# EAGLE design a201-kill-eq (EAGLE 7.5.1)
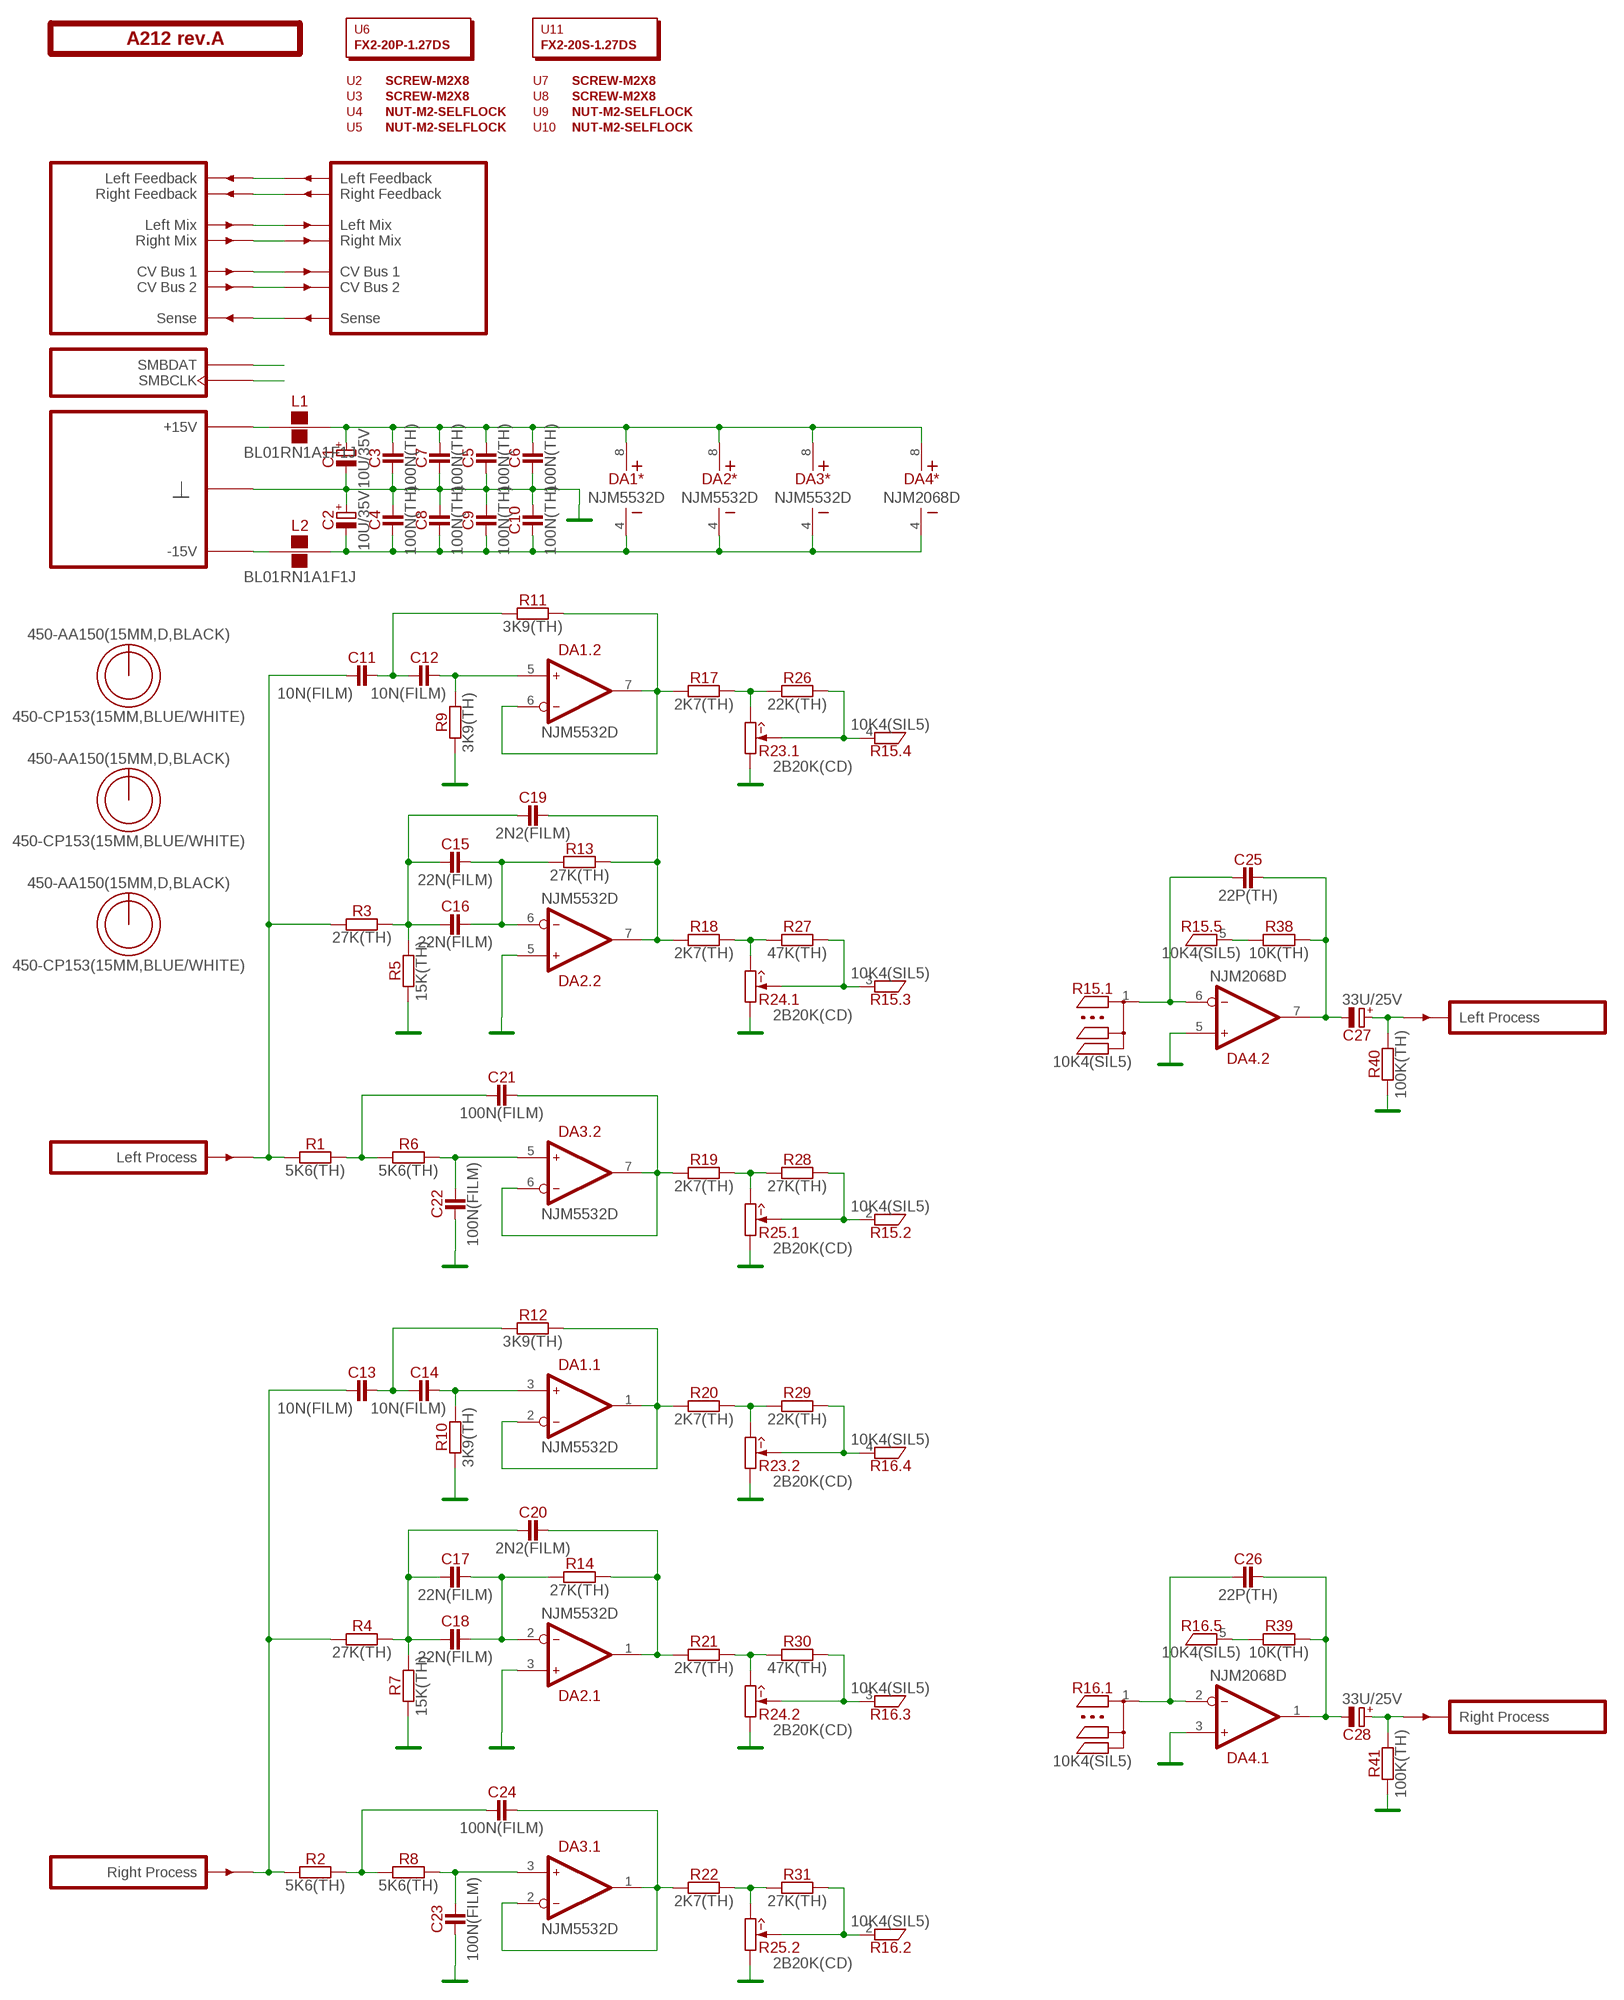
[diagram p0: schematic, sheet 1]

## Parts
C1  10U/35V  [E2-5]
C2  10U/35V  [E2-5]
C3  100N(TH)  [C050-024X044]
C4  100N(TH)  [C050-024X044]
C5  100N(TH)  [C050-024X044]
C6  100N(TH)  [C050-024X044]
C7  100N(TH)  [C050-024X044]
C8  100N(TH)  [C050-024X044]
C9  100N(TH)  [C050-024X044]
C10  100N(TH)  [C050-024X044]
C11  10N(FILM)  [C050-025X075]
C12  10N(FILM)  [C050-025X075]
C13  10N(FILM)  [C050-025X075]
C14  10N(FILM)  [C050-025X075]
C15  22N(FILM)  [C050-025X075]
C16  22N(FILM)  [C050-025X075]
C17  22N(FILM)  [C050-025X075]
C18  22N(FILM)  [C050-025X075]
C19  2N2(FILM)  [C050-025X075]
C20  2N2(FILM)  [C050-025X075]
C21  100N(FILM)  [C050-025X075]
C22  100N(FILM)  [C050-025X075]
C23  100N(FILM)  [C050-025X075]
C24  100N(FILM)  [C050-025X075]
C25  22P(TH)  [C050-024X044]
C26  22P(TH)  [C050-024X044]
C27  33U/25V  [E2,5-7]
C28  33U/25V  [E2,5-7]
DA1  NJM5532D  [DIP-8]
DA2  NJM5532D  [DIP-8]
DA3  NJM5532D  [DIP-8]
DA4  NJM2068D  [DIP-8]
L1  BL01RN1A1F1J  [BL01RN1A]
L2  BL01RN1A1F1J  [BL01RN1A]
O1  450-AA150(15MM,D,BLACK)  [EMPTY]
O2  450-AA150(15MM,D,BLACK)  [EMPTY]
O3  450-AA150(15MM,D,BLACK)  [EMPTY]
O4  450-CP153(15MM,BLUE/WHITE)  [EMPTY]
O5  450-CP153(15MM,BLUE/WHITE)  [EMPTY]
O6  450-CP153(15MM,BLUE/WHITE)  [EMPTY]
PCB1  A212 rev.A  ST2-BOARD-50  [ST2-BOARD-50]
R1  5K6(TH)  [R-0207/10]
R2  5K6(TH)  [R-0207/10]
R3  27K(TH)  [R-0207/10]
R4  27K(TH)  [R-0207/10]
R5  15K(TH)  [R-0207/10]
R6  5K6(TH)  [R-0207/10]
R7  15K(TH)  [R-0207/10]
R8  5K6(TH)  [R-0207/10]
R9  3K9(TH)  [R-0207/10]
R10  3K9(TH)  [R-0207/10]
R11  3K9(TH)  [R-0207/10]
R12  3K9(TH)  [R-0207/10]
R13  27K(TH)  [R-0207/10]
R14  27K(TH)  [R-0207/10]
R15  10K4(SIL5)  [R-SIL5]
R16  10K4(SIL5)  [R-SIL5]
R17  2K7(TH)  [R-0207/10]
R18  2K7(TH)  [R-0207/10]
R19  2K7(TH)  [R-0207/10]
R20  2K7(TH)  [R-0207/10]
R21  2K7(TH)  [R-0207/10]
R22  2K7(TH)  [R-0207/10]
R23  2B20K(CD)  [RV11-DUAL]
R24  2B20K(CD)  [RV11-DUAL]
R25  2B20K(CD)  [RV11-DUAL]
R26  22K(TH)  [R-0207/10]
R27  47K(TH)  [R-0207/10]
R28  27K(TH)  [R-0207/10]
R29  22K(TH)  [R-0207/10]
R30  47K(TH)  [R-0207/10]
R31  27K(TH)  [R-0207/10]
R38  10K(TH)  [R-0207/10]
R39  10K(TH)  [R-0207/10]
R40  100K(TH)  [R-0207/10]
R41  100K(TH)  [R-0207/10]
U2  SCREW-M2X8  [EMPTY]
U3  SCREW-M2X8  [EMPTY]
U4  NUT-M2-SELFLOCK  [EMPTY]
U5  NUT-M2-SELFLOCK  [EMPTY]
U6  FX2-20P-1.27DS  [EMPTY]
U7  SCREW-M2X8  [EMPTY]
U8  SCREW-M2X8  [EMPTY]
U9  NUT-M2-SELFLOCK  [EMPTY]
U10  NUT-M2-SELFLOCK  [EMPTY]
U11  FX2-20S-1.27DS  [EMPTY]

## Nets
GND: C1.- C2.+ C3.1 C4.2 C5.1 C6.1 C7.1 C8.2 C9.2 C10.2 C22.1 C23.1 DA2.3(.1:IN+) DA2.5(.2:IN+) DA4.3(.1:IN+) DA4.5(.2:IN+) PCB1.B4'(GND) PCB1.B4(GND) PCB1.B5'(GND) PCB1.B5(GND) PCB1.B6'(GND) PCB1.B6(GND) PCB1.B7'(GND) PCB1.B7(GND) PCB1.B8'(GND) PCB1.B8(GND) R5.1 R7.1 R9.1 R10.1 R23.1'(.2:CCW) R23.1(.1:CCW) R24.1'(.2:CCW) R24.1(.1:CCW) R25.1'(.2:CCW) R25.1(.1:CCW) R40.1 R41.1
LIO: C11.1 PCB1.BINL(INL) R1.1 R3.1
LIO': C27.+ PCB1.BOUTL'(OUTL) R40.2
N$1: PCB1.ALFBK'(LFBK') PCB1.ALFBK(LFBK)
N$2: PCB1.ARFBK'(RFBK') PCB1.ARFBK(RFBK)
N$3: PCB1.ALMIX'(LMIX') PCB1.ALMIX(LMIX)
N$4: PCB1.ARMIX'(RMIX') PCB1.ARMIX(RMIX)
N$5: PCB1.ACV1'(CV1') PCB1.ACV1(CV1)
N$6: PCB1.ACV2'(CV2') PCB1.ACV2(CV2)
N$7: PCB1.BSENSE'(SENSE') PCB1.BSENSE(SENSE)
N$8: PCB1.ASMBDAT'(SMBDAT) PCB1.ASMBDAT(SMBDAT)
N$9: PCB1.ASMBCLK'(SMBCLK) PCB1.ASMBCLK(SMBCLK)
N$10: C11.2 C12.1 R11.1
N$11: C12.2 DA1.5(.2:IN+) R9.2
N$12: DA1.6(.2:IN-) DA1.7(.2:OUT) R11.2 R17.1
N$13: R17.2 R23.3(.1:CW) R26.1
N$14: R15.4 R23.2(.1:W) R26.2
N$15: C15.1 C16.1 C19.1 R3.2 R5.2
N$16: C15.2 C16.2 DA2.6(.2:IN-) R13.1
N$17: C19.2 DA2.7(.2:OUT) R13.2 R18.1
N$18: R18.2 R24.3(.1:CW) R27.1
N$19: R15.3 R24.2(.1:W) R27.2
N$20: C21.1 R1.2 R6.1
N$21: C22.2 DA3.5(.2:IN+) R6.2
N$22: C21.2 DA3.6(.2:IN-) DA3.7(.2:OUT) R19.1
N$23: R19.2 R25.3(.1:CW) R28.1
N$24: R15.2 R25.2(.1:W) R28.2
N$25: L1.1 PCB1.A+15'(P+15V) PCB1.A+15(P+15V) PCB1.B+15'(P+15V) PCB1.B+15(P+15V)
N$26: R16.5 R39.1
N$27: C13.2 C14.1 R12.1
N$28: C14.2 DA1.3(.1:IN+) R10.2
N$29: DA1.1(.1:OUT) DA1.2(.1:IN-) R12.2 R20.1
N$30: R20.2 R23.3'(.2:CW) R29.1
N$31: R16.4 R23.2'(.2:W) R29.2
N$32: R15.5 R38.1
N$33: C17.1 C18.1 C20.1 R4.2 R7.2
N$34: C17.2 C18.2 DA2.2(.1:IN-) R14.1
N$35: C20.2 DA2.1(.1:OUT) R14.2 R21.1
N$36: R21.2 R24.3'(.2:CW) R30.1
N$37: R16.3 R24.2'(.2:W) R30.2
N$38: C25.2 C27.- DA4.7(.2:OUT) R38.2
N$39: C24.1 R2.2 R8.1
N$40: C23.2 DA3.3(.1:IN+) R8.2
N$41: C24.2 DA3.1(.1:OUT) DA3.2(.1:IN-) R22.1
N$42: R22.2 R25.3'(.2:CW) R31.1
N$43: R16.2 R25.2'(.2:W) R31.2
N$44: C26.2 C28.- DA4.1(.1:OUT) R39.2
N$45: C1.+ C3.2 C5.2 C6.2 C7.2 DA1.8(*:V+) DA2.8(*:V+) DA3.8(*:V+) DA4.8(*:V+) L1.2
N$46: L2.1 PCB1.A-15'(P-15V) PCB1.A-15(P-15V) PCB1.B-15'(P-15V) PCB1.B-15(P-15V)
N$47: C2.- C4.1 C8.1 C9.1 C10.1 DA1.4(*:V-) DA2.4(*:V-) DA3.4(*:V-) DA4.4(*:V-) L2.2
N$48: C28.+ PCB1.BOUTR'(OUTR) R41.2
N$49: C25.1 DA4.6(.2:IN-) R15.1
N$50: C26.1 DA4.2(.1:IN-) R16.1
RIO: C13.1 PCB1.BINR(INR) R2.1 R4.1

## Library data of the parts
C1 C2 = capacitors-electrolytic:?; MOUSER: 647-USW1V100MDD
C3-C10 = capacitors:?; MOUSER: 81-RCER71H104K0A2H3B
C11-C14 = capacitors:?; MOUSER: 80-F622JF103J100C
C15-C18 = capacitors:?; MOUSER: 80-R82EC2220DQ50J
C19 C20 = capacitors:?; MOUSER: 80-PHE426DJ4220JR05
C21-C24 = capacitors:?; MOUSER: 505-MKS2.1/63/5
C25 C26 = capacitors:?
C27 C28 = capacitors-electrolytic:?
DA1-DA3 = ic-jrc:NJM5532; MOUSER: 513-NJM5532D
DA4 = ic-jrc:NJM2068; MOUSER: 513-NJM2068D
L1 L2 = inductors:BL01RN1A?; MOUSER: 81-BL01RN1A1F1J
O1-O3 = hardware:450-AA?; MOUSER: 450-AA150
O4-O6 = hardware:450-C?; MOUSER: 450-CP153
PCB1 = module-footprints:ST2-BOARD-?
R1-R14 R17-R22 R27 R28 R30 R31 = resistors:?
R15 R16 = resistors:?**4(SIL5); MOUSER: 858-L051S103LF
R23-R25 = potentiometers:2**?; MOUSER: 688-RK12L1230C1M
R26 R29 = resistors:?; MOUSER: 71-CCF0722K0GKE36
R38 R39 = resistors:?; MOUSER: 71-RN55D-F-10K
R40 R41 = resistors:?; MOUSER: 71-RN55D-F-100K
U2-U5 U7-U10 = hardware:*?
U6 = hardware:?; MOUSER: 798-FX2-20P-1.27DS71
U11 = hardware:?; MOUSER: 798-FX2-20S-1.27DS71

## Board
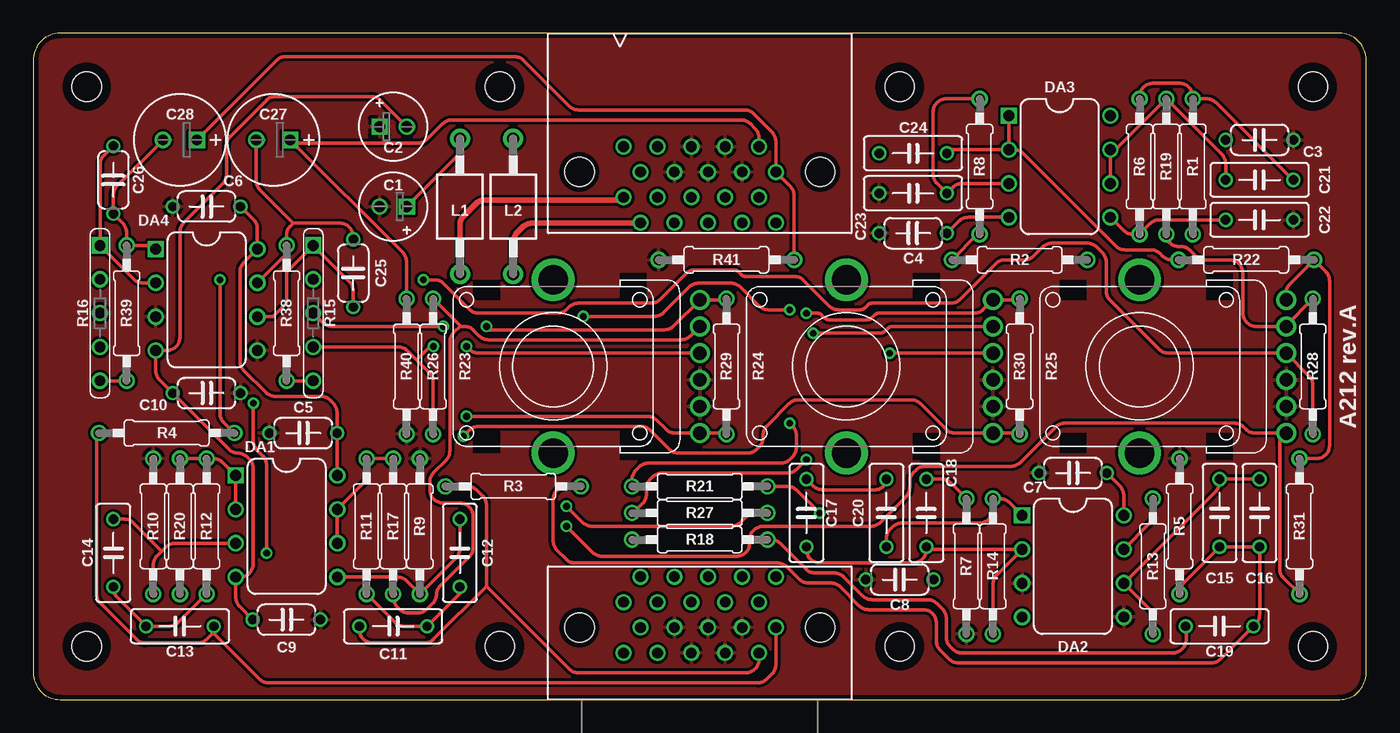
[diagram p1: board, top side]
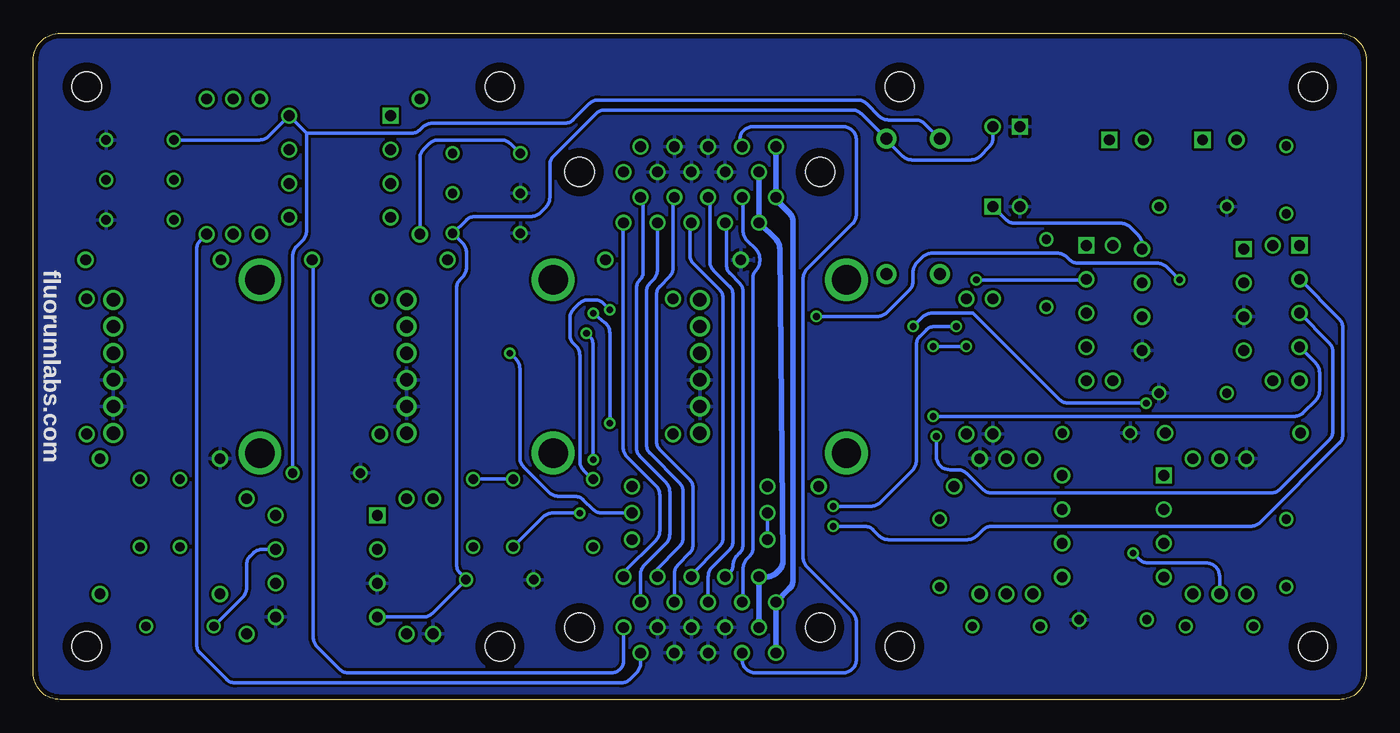
[diagram p2: board, bottom side, seen from below]

Size 100 x 50 mm. Coordinates in mm from the lower left corner, seen from the top.
Outline: 0,48 0,2 arc90 2,0 98,0 arc90 100,2 100,48 arc90 98,50 2,50 arc90 0,48
Copper layers (1*16): Top 0.0356mm / dielectric 1.5011mm / Bottom 0.0356mm
Design rules "sonictrain": minimum track width 6mil, minimum drill 13mil, track to track 8mil, track to pad 8mil, pad to pad 6mil, via to via 6mil, smd to smd 6mil, copper to edge 15mil, drill to drill 6mil, minimum pad ring 7mil, minimum via ring 7mil, stop-mask expansion 3mil, vias tented up to drill 25mil, thermal gap 10mil

### Footprints (pad centres in the part's own frame; a part is rotated, then mirrored left to right if it is on the bottom)
E2-5 = drill 0.813 square: + -1.016,0 | drill 0.813: - 1.016,0
C050-024X044 = drill 0.7: 1 -2.54,0; 2 2.54,0
C050-025X075 = drill 0.7: 1 -2.54,0; 2 2.54,0
E2,5-7 = drill 0.813 square: + -1.27,0 | drill 0.813: - 1.27,0
DIP-8 = drill 0.813 square: 1 -3.81,-3.81 | drill 0.813: 2 -1.27,-3.81; 3 1.27,-3.81; 4 3.81,-3.81; 5 3.81,3.81; 6 1.27,3.81; 7 -1.27,3.81; 8 -3.81,3.81
BL01RN1A = drill 0.9 pad 1.5: 1 -5.08,0; 2 5.08,0
ST2-BOARD-50 = drill 0.8: A+15 44.285,7.31; A+15' 44.285,37.69; A-15 45.555,9.215; A-15' 45.555,35.785; ACV1 51.905,7.31; ACV1' 51.905,37.69; ACV2 53.175,9.215; ACV2' 53.175,35.785; ALFBK 49.365,7.31; ALFBK' 49.365,37.69; ALMIX 46.825,7.31; ALMIX' 46.825,37.69; ARFBK 50.635,9.215; ARFBK' 50.635,35.785; ARMIX 48.095,9.215; ARMIX' 48.095,35.785; ASMBCLK 55.715,9.215; ASMBCLK' 55.715,35.785; ASMBDAT 54.445,7.31; ASMBDAT' 54.445,37.69; B4 48.095,5.405; B4' 48.095,39.595; B5 49.365,3.5; B5' 49.365,41.5; B6 50.635,5.405; B6' 50.635,39.595; B7 51.905,3.5; B7' 51.905,41.5; B8 53.175,5.405; B8' 53.175,39.595; B+15 44.285,3.5; B+15' 44.285,41.5; B-15 45.555,5.405; B-15' 45.555,39.595; BINL 54.445,3.5; BINR 55.715,5.405; BOUTL' 54.445,41.5; BOUTR' 55.715,39.595; BSENSE 46.825,3.5; BSENSE' 46.825,41.5 | hole 2.2: 4,4; 4,46; 96,4; 96,46; 35,46; 65,46; 65,4; 35,4; 59.025,5.405; 40.975,5.405; 40.975,39.595; 59.025,39.595
R-0207/10 = drill 0.813: 1 -5.08,0; 2 5.08,0
R-SIL5 = drill 0.813 square: 1 -5.08,0 | drill 0.813: 2 -2.54,0; 3 0,0; 4 2.54,0; 5 5.08,0
RV11-DUAL = drill 1: 1 -1,-11; 1' -3,-11; 2 1,-11; 2' -5,-11; 3 3,-11; 3' 5,-11 | drill 2.2: S1 -6.5,0; S2 6.5,0

### Placement (x,y rotation side)
C1  27,37 180 top
C2  27,43 0 top
C3  92,42 180 top
C4  66,35 180 top
C5  20.25,20 0 top
C6  13,37 0 top
C7  78,17 0 top
C8  65,9 180 top
C9  19,6 0 top
C10  13,23 0 top
C11  27,5.5 0 top
C12  32,11 90 top
C13  11,5.5 180 top
C14  6,11 90 top
C15  89,14 90 top
C16  92,14 90 top
C17  58,14 270 top
C18  67,14 270 top
C19  89,5.5 180 top
C20  64,14 270 top
C21  92,39 180 top
C22  92,36 180 top
C23  66,38 0 top
C24  66,41 0 top
C25  24,32 90 top
C26  6,39 270 top
C27  18,42 180 top
C28  11,42 180 top
DA1  19,13 270 top
DA2  78,10 270 top
DA3  77,40 270 top
DA4  13,30 270 top
L1  32,37 90 top
L2  36,37 90 top
O1  93,-108 0 top  (outside the outline)
O2  96,-108 0 top  (outside the outline)
O3  99,-108 0 top  (outside the outline)
O4  102,-108 0 top  (outside the outline)
O5  2,-111 0 top  (outside the outline)
O6  5,-111 0 top  (outside the outline)
PCB1  0,0 0 top
R1  87,40 90 top
R2  74,33 180 top
R3  36,16 0 top
R4  10,20 0 top
R5  86,13 270 top
R6  83,40 270 top
R7  70,10 90 top
R8  71,40 90 top
R9  29,13 270 top
R10  9,13 270 top
R11  25,13 90 top
R12  13,13 90 top
R13  84,10 90 top
R14  72,10 90 top
R15  10K*4(SIL5)  [R-SIL5]  21,29 270 top
R16  10K*4(SIL5)  [R-SIL5]  5,29 270 top
R17  27,13 270 top
R18  50,12 180 top
R19  85,40 270 top
R20  11,13 270 top
R21  50,16 180 top
R22  91,33 0 top
R23  2*B20K(CD)  [RV11-DUAL]  39,25 90 top
R24  2*B20K(CD)  [RV11-DUAL]  61,25 90 top
R25  2*B20K(CD)  [RV11-DUAL]  83,25 90 top
R26  30,25 270 top
R27  50,14 0 top
R28  96,25 270 top
R29  52,25 270 top
R30  74,25 270 top
R31  95,13 270 top
R38  19,29 90 top
R39  7,29 90 top
R40  28,25 90 top
R41  52,33 0 top
U2  8,-111 0 top  (outside the outline)
U3  11,-111 0 top  (outside the outline)
U4  14,-111 0 top  (outside the outline)
U5  17,-111 0 top  (outside the outline)
U6  20,-111 0 top  (outside the outline)
U7  23,-111 0 top  (outside the outline)
U8  26,-111 0 top  (outside the outline)
U9  29,-111 0 top  (outside the outline)
U10  32,-111 0 top  (outside the outline)
U11  35,-111 0 top  (outside the outline)

### Tracks (layer width: path | path; a pad name or v marks a point on that pad's centre or on a via)
GND
  pour Bottom: 0,50 100,50 100,0 0,0
  pour Top: 0,50 100,50 100,0 0,0
LIO
  Top 0.254: C11.1 24.46,5.25 arc90 25.46,4.25 29.34,4.25 arc45 30.04,4.54 34,8.5 | 34,8.5 34,14.59 arc45 33.71,15.29 33.29,15.71 arc45 32.59,16 R3.1 | PCB1.BINL 54.45,3 arc-90 53.45,2 40.91,2 arc-45 40.21,2.29 34,8.5
  Bottom 0.254: PCB1.BINL 54.45,2.72 arc45 54.74,2.01 55.21,1.54 arc45 55.91,1.25 84.84,1.25 arc45 85.54,1.54 87.46,3.46 arc45 87.75,4.16 87.75,33.76 arc45 87.46,34.46 R1.1
LIO'
  Top 0.254: R40.2 28,32.86 arc45 27.71,33.56 C27.+ 19.52,41.75 28.84,41.75 arc45 29.54,42.04 30.71,43.21 arc-45 31.41,43.5 53.09,43.5 arc-45 53.79,43.21 54.15,42.85 arc-45 54.45,42.14 PCB1.BOUTL'
N$1
  Bottom 0.254: PCB1.ALFBK 49.37,9.22 arc45 49.07,9.93 47.79,11.21 arc-45 47.5,11.91 47.5,30.34 arc-45 47.79,31.04 48.96,32.21 arc45 49.25,32.91 49.25,37.58 PCB1.ALFBK'
N$2
  Bottom 0.254: PCB1.ARFBK 50.63,9.37 48.54,11.46 arc-45 48.25,12.16 48.25,30.09 arc-45 48.54,30.79 50.46,32.71 arc45 50.75,33.41 50.75,35.67 PCB1.ARFBK'
N$3
  Bottom 0.254: PCB1.ALMIX' 46.75,37.62 46.75,35.16 arc-45 46.46,34.46 45.79,33.79 arc45 45.5,33.09 45.5,32.91 arc45 45.79,32.21 arc-45 46,31.71 46,11.41 arc45 46.29,10.71 46.46,10.54 arc-45 46.75,9.84 46.75,7.38 PCB1.ALMIX
N$4
  Bottom 0.254: PCB1.ARMIX 48.03,9.21 47.74,9.51 arc-45 47.5,10.09 arc45 47.21,10.79 47.04,10.96 arc-45 46.75,11.66 46.75,30.59 arc-45 47.04,31.29 47.71,31.96 arc45 48,32.66 48,35.69 PCB1.ARMIX'
N$5
  Bottom 0.254: PCB1.ACV1' 52,37.59 52,32.41 arc45 52.29,31.71 52.96,31.04 arc-45 53.25,30.34 53.25,19.41 arc-45 52.96,18.71 50.79,16.54 arc45 50.5,15.84 50.5,11.66 arc45 50.79,10.96 51.61,10.14 arc-45 51.91,9.43 PCB1.ACV1
N$6
  Bottom 0.254: PCB1.ACV2' 53.17,32.24 arc45 53.47,31.53 53.71,31.29 arc-45 54,30.59 54,19.16 arc-45 53.71,18.46 51.54,16.29 arc45 51.25,15.59 51.25,12.16 arc45 51.54,11.46 53.25,9.75 53.25,9.29 PCB1.ACV2
N$7
  Bottom 0.254: PCB1.BSENSE 46.83,3 arc-90 45.83,2 39.25,2 arc-90 38.25,3 38.25,5.84 arc-45 38.54,6.54 41.96,9.96 arc45 42.25,10.66 42.25,31.59 arc45 41.96,32.29 38.54,35.71 arc-45 38.25,36.41 38.25,42 arc-90 39.25,43 46,43 arc-90 47,42 47,41.67 PCB1.BSENSE'
N$8
  Bottom 0.254: PCB1.ASMBDAT' 54.25,37.49 54.25,32.04 arc45 54.46,31.54 arc-45 54.75,30.84 54.75,18.91 arc-45 54.46,18.21 52.54,16.29 arc45 52.25,15.59 52.25,12.41 arc45 52.54,11.71 54.15,10.1 arc-45 54.45,9.39 PCB1.ASMBDAT
N$9
  Bottom 0.254: PCB1.ASMBCLK 55.72,9.54 53.29,11.96 arc-45 53,12.66 53,15.34 arc-45 53.29,16.04 55.46,18.21 arc45 55.75,18.91 55.75,35.75 PCB1.ASMBCLK'
N$10
  Top 0.254: R11.1 27.13,5.79 arc45 27.83,5.5 C11.2 32,7.96 C12.1
N$11
  Top 0.254: DA1.5 27.32,9.19 arc-45 28.02,8.9 R9.2 31.71,10.63 arc45 32,11.33 C12.2
N$12
  Top 0.254: DA1.6 DA1.7 24.71,16.17 arc45 25,16.87 R11.2 R17.1
N$13
  Top 0.254: 32.04,28.04 32.08,28 32.34,28 arc-45 33.04,27.71 33.46,27.29 arc45 34.16,27 48.59,27 arc45 49.29,27.29 R23.3 | 32.04,28.04 R26.1 | R17.2 27,7.66 arc45 27.29,6.96 27.46,6.79 arc45 28.16,6.5 28.84,6.5 arc45 29.54,6.79 29.96,7.21 arc45 30.25,7.91 arc-45 30.49,8.49 32.71,10.71 arc45 33,11.41 33,13.75 arc90 32,14.75 30.75,14.75 arc-90 29.75,15.75 29.75,16.34 arc-45 30.04,17.04 30.96,17.96 arc45 31.25,18.66 31.25,26.84 arc-45 31.54,27.54 32.04,28.04
N$14  (via drill 0.5)
  Top 0.254: R15.4 27.38,26.46 arc-45 28.08,26.17 28.75,25.5 | 28.75,25.5 29.71,24.54 arc-45 30,23.84 R26.2 | R23.2 33.41,26 arc-45 32.71,26.29 v32.5,26.5 | v30,26.5 29.75,26.5 28.75,25.5
  Bottom 0.254: 21.04,26.5 R15.4 | v32.5,26.5 v30,26.5
N$15
  Top 0.254: R5.2 86,8.46 C15.1 C16.1 92,6.37 arc-45 91.71,5.67 C19.1 89.08,3.04 arc-45 88.38,2.75 69.41,2.75 arc-45 68.71,3.04 68.04,3.71 arc-45 67.75,4.41 67.75,5.75 arc90 66.75,6.75 62.66,6.75 arc-45 61.96,7.04 60.54,8.46 arc45 59.84,8.75 58.16,8.75 arc-45 57.46,9.04 56.54,9.96 arc45 55.84,10.25 40.66,10.25 arc-45 39.96,10.54 39.29,11.21 arc-45 39,11.91 39,15 arc-90 40,16 R3.2
N$16
  Top 0.254: C16.2 C15.2 89,16.33 arc-45 88.71,15.63 DA2.6 83.71,6.83 arc-45 84,6.13 R13.1
N$17
  Top 0.254: R13.2 84,13.87 arc-45 83.71,13.17 DA2.7 | R18.1 55.34,12 arc-45 56.04,11.71 57.96,9.79 arc45 58.66,9.5 60.09,9.5 arc-45 60.79,9.21 62.21,7.79 arc45 62.91,7.5 67.09,7.5 arc-45 67.79,7.21 68.21,6.79 arc-45 68.5,6.09 68.5,4.66 arc45 68.79,3.96 68.96,3.79 arc45 69.66,3.5 85.5,3.5 arc90 86.5,4.5 86.5,5.46 C19.2
  Bottom 0.254: DA2.7 82.82,11.27 arc-45 83.52,10.98 83.71,10.79 arc-45 84,10.09 84,8.37 arc45 84.29,7.67 C19.2
N$18  (via drill 0.5)
  Top 0.254: R27.1 45,14 45.71,14.71 arc45 46,15.41 46,15.84 arc-45 46.29,16.54 46.46,16.71 arc-45 47.16,17 56.59,17 arc45 57.29,17.29 v58,18 | v58.5,27.5 63.54,27.5 arc45 63.9,27.65 64.1,27.85 arc-45 64.46,28 R24.3
  Bottom 0.254: v58,18 58,26.59 arc-45 58.29,27.29 v58.5,27.5 | R18.2 R27.1
N$19  (via drill 0.5)
  Top 0.254: v64.25,26 R24.2 | R27.2 54.16,14 arc45 53.46,13.71 53.04,13.29 arc-45 52.34,13 41.91,13 arc-45 41.21,13.29 v40,14.5 | v30.75,28 22.41,28 arc-45 21.71,28.29 R15.3
  Bottom 0.254: R27.2 57.34,14 arc45 58.04,14.29 58.71,14.96 arc-45 59.41,15.25 60.59,15.25 arc45 61.29,15.54 63.21,17.46 arc45 63.5,18.16 63.5,24.84 arc-45 63.79,25.54 v64.25,26 | v40,14.5 37.16,14.5 arc-45 36.46,14.79 34.04,17.21 arc-45 33.75,17.91 33.75,26.59 arc45 33.46,27.29 33.04,27.71 arc45 32.34,28 v30.75,28
N$20
  Top 0.254: R6.1 83,45.25 arc-90 84,46.25 86,46.25 arc-90 87,45.25 R1.2 88.05,45.08 arc-45 88.75,44.79 C21.1
N$21
  Top 0.254: DA3.5 81.79,35.21 arc45 82.49,34.92 R6.2 83.79,35.71 arc-45 84.49,36 C22.2
N$22
  Top 0.254: DA3.6 DA3.7 arc45 81.46,41.54 R19.1 89.17,40.91 arc-45 89.46,40.21 C21.2
N$23
  Top 0.254: R28.1 94,28.08 R25.3 91.75,28 arc-90 90.75,29 90.75,32 arc90 89.75,33 87.91,33 arc-45 87.21,33.29 86.79,33.71 arc45 86.09,34 85.92,34 arc-90 R19.2
N$24  (via drill 0.5)
  Top 0.254: R28.2 96,23.59 arc45 95.71,24.29 R25.2 85.16,26 arc-45 84.46,26.29 80.79,29.96 arc-45 80.5,30.66 80.5,32.84 arc45 80.21,33.54 79.79,33.96 arc45 79.09,34.25 76.41,34.25 arc45 75.71,33.96 75.04,33.29 arc-45 74.34,33 72.91,33 arc45 72.21,32.71 69.54,30.04 arc-45 68.84,29.75 62.96,29.75 arc45 62.6,29.6 62.4,29.4 arc-45 62.04,29.25 60.41,29.25 arc-45 59.71,29.54 57.79,31.46 arc45 57.09,31.75 53.46,31.75 arc-45 53.1,31.9 52.9,32.1 arc45 52.54,32.25 49.66,32.25 arc45 48.96,31.96 47.04,30.04 arc-45 46.34,29.75 40.91,29.75 arc45 40.21,29.46 40.04,29.29 arc-45 39.34,29 33.41,29 arc-45 32.71,29.29 30.79,31.21 arc45 30.09,31.5 v29.25,31.5
  Bottom 0.254: v29.25,31.5 21.04,31.5 R15.2
N$25
  Top 0.406: L1.1 32,35.59 arc-45 32.29,36.29 33.21,37.21 arc-45 33.91,37.5 44.09,37.5 PCB1.A+15'
  Bottom 0.406: PCB1.B+15 PCB1.A+15 43.29,8.3 arc-45 43,9.01 43,35.84 arc-45 43.29,36.54 44.28,37.53 PCB1.A+15' PCB1.B+15'
N$26
  Top 0.254: R16.5 R39.1
N$27
  Top 0.254: C14.1 6,8.37 arc45 6.29,7.67 C13.2 10.17,5.5 arc45 10.87,5.79 R12.1
N$28
  Top 0.254: DA1.3 10.64,11.73 arc45 9.94,11.44 9.62,11.12 | 9.62,11.12 9.29,10.79 arc45 9,10.09 R10.2 | C14.2 6.8,13.54 arc-45 7.5,13.25 9.62,11.12
N$29
  Top 0.254: R20.1 R12.2 13.51,18.08 arc-45 14.21,17.79 DA1.1 DA1.2
N$30  (via drill 0.5)
  Top 0.254: R29.1 51.92,30 R23.3' 48.04,28.04 arc-45 47.34,27.75 34.25,27.75 v34,28 | v17.5,11 17.5,17.59 arc45 17.21,18.29 16.79,18.71 arc-45 16.5,19.41 v16.5,22.25
  Bottom 0.254: v34,28 33.29,28.71 arc45 32.59,29 29.5,29 23.04,22.54 arc-45 22.34,22.25 v16.5,22.25 | R20.2 11,9.25 arc-90 12,10.25 16.34,10.25 arc45 17.04,10.54 v17.5,11
N$31  (via drill 0.5)
  Top 0.254: R29.2 51.92,20 R23.2' 48.16,20 arc-45 47.46,20.29 46.79,20.96 arc45 46.09,21.25 v32.5,21.25
  Bottom 0.254: v32.5,21.25 5.41,21.25 arc-45 4.71,21.54 3.79,22.46 arc-45 3.5,23.16 3.5,24.55 arc-45 3.79,25.25 R16.4
N$32
  Top 0.254: R38.1 R15.5
N$33  (via drill 0.5)
  Top 0.254: C18.1 68.13,16.54 arc-45 68.83,16.25 R7.2 | C20.1 arc-90 63.21,15.75 59.2,15.75 arc-45 58.5,16.04 C17.1 | v56.75,29.25 55.16,29.25 arc-45 54.46,29.54 53.04,30.96 arc45 52.34,31.25 49.91,31.25 arc45 49.21,30.96 47.29,29.04 arc-45 46.59,28.75 v41.25,28.75 | v14,31.5 14,21.49 arc45 14.29,20.79 R4.2
  Bottom 0.254: C20.1 C18.1 | C17.1 58.04,16.54 58.71,17.21 arc45 59,17.91 59,25.84 arc-45 59.29,26.54 59.46,26.71 arc45 59.75,27.41 59.75,28.59 arc45 59.46,29.29 59.04,29.71 arc45 58.34,30 57.91,30 arc45 57.21,29.71 v56.75,29.25 | v41.25,28.75 36.66,28.75 arc-45 35.96,29.04 34.29,30.71 arc-45 34,31.41 34,32.09 arc45 33.71,32.79 33.29,33.21 arc45 32.59,33.5 23.16,33.5 arc45 22.46,33.21 22.29,33.04 arc-45 21.59,32.75 15.66,32.75 arc45 14.96,32.46 v14,31.5
N$34
  Top 0.254: R14.1 72,8.67 arc-45 72.29,9.37 DA2.2 67.19,11.27 C18.2 67,11.25 arc-90 66,10.25 59,10.25 arc-90 58,11.25 C17.2
N$35  (via drill 0.5)
  Top 0.254: DA2.1 73.21,14.79 arc45 72.51,15.08 R14.2 72,14.25 arc-90 71,13.25 65.16,13.25 arc45 64.46,12.96 64.29,12.79 arc45 64,12.09 C20.2 | R21.1 56.59,16 arc-45 57.29,15.71 v59,14
  Bottom 0.254: v59,14 61.05,14 arc-45 61.75,13.71 C20.2
N$36  (via drill 0.5)
  Top 0.254: R30.1 73.92,30 R24.3' 71.29,29.29 arc-45 70.59,29 63.46,29 arc45 63.1,28.85 62.9,28.65 arc-45 62.54,28.5 59.71,28.5 arc-45 59.35,28.65 59.15,28.85 arc45 58.79,29 v58,29 | R21.2 44.92,16.51 arc-45 45.21,17.21 45.46,17.46 arc-45 46.16,17.75 56.09,17.75 arc45 56.79,18.04 56.96,18.21 arc45 57.25,18.91 57.25,19.84 arc45 56.96,20.54 v56.75,20.75
  Bottom 0.254: v56.75,20.75 56.75,27.52 arc-51 57.12,28.3 v58,29
N$37  (via drill 0.5)
  Top 0.254: R30.2 73.92,20 R24.2' 69.16,20 arc-45 68.46,20.29 66.54,22.21 arc45 65.84,22.5 57.41,22.5 arc45 56.71,22.21 55.04,20.54 arc45 54.75,19.84 54.75,19.66 arc-45 54.46,18.96 54.29,18.79 arc-45 53.59,18.5 48.41,18.5 arc-45 47.71,18.79 46.29,20.21 arc45 45.59,20.5 33.41,20.5 arc45 32.71,20.21 v32.25,19.75
  Bottom 0.254: R16.3 2.79,26.79 arc45 2.5,26.09 2.5,20.16 arc45 2.79,19.46 6.46,15.79 arc45 7.16,15.5 28.09,15.5 arc45 28.79,15.79 29.96,16.96 arc-45 30.66,17.25 31.25,17.25 arc90 32.25,18.25 v32.25,19.75
N$38
  Top 0.254: DA4.7 19,33.46 R38.2 19,34.84 arc-45 19.29,35.54 19.5,35.75 | 19.5,35.75 23,35.75 arc-90 24,34.75 C25.2 | C27.- 16.73,38.93 arc45 17.02,38.23 19.5,35.75
N$39
  Top 0.254: R8.1 70.84,34.92 R2.2
  Bottom 0.254: C24.1 63.5,41 64.21,41.71 arc-45 64.91,42 69.59,42 arc-45 70.29,41.71 70.71,41.29 arc-45 71,40.59 R8.1
N$40
  Top 0.254: DA3.3 69.68,38.73 arc45 68.98,38.44 C23.2 67.79,38.75 arc-45 67.5,39.45 67.5,44.08 arc-90 68.5,45.08 R8.2
N$41
  Top 0.254: DA3.2 DA3.1 | DA3.2 69.19,41.27 arc45 C24.2 | R22.1 85.41,33 arc-45 84.71,33.29 84.54,33.46 arc45 83.84,33.75 81.91,33.75 arc-45 81.21,34.04 74.29,40.96 arc45 73.59,41.25 73.21,41.25 DA3.2
N$42
  Top 0.254: R25.3' 94,30.51 arc-45 94.29,31.21 R22.2 96.96,32.12 arc-45 97.25,31.42 97.25,19.08 arc-90 96.25,18.08 R31.1
N$43  (via drill 0.5)
  Top 0.254: R31.2 93.79,9.13 arc-45 93.5,9.83 93.5,19.09 arc-45 93.79,19.79 R25.2' 91.66,20 arc-45 90.96,20.29 90.79,20.46 arc45 90.09,20.75 77.41,20.75 arc45 76.71,20.46 74.04,17.79 arc-45 73.34,17.5 66.91,17.5 arc45 66.21,17.21 66.04,17.04 arc45 65.75,16.34 65.75,15.91 arc-45 65.46,15.21 63.54,13.29 arc-45 62.84,13 54.75,13 arc90 53.75,12 53.75,11.75 arc-90 52.75,10.75 42.66,10.75 arc-45 41.96,11.04 v40,13
  Bottom 0.254: v40,13 37.66,13 arc45 36.96,12.71 36.54,12.29 arc-45 35.84,12 29.91,12 arc-45 29.21,12.29 28.79,12.71 arc45 28.09,13 8.66,13 arc-45 7.96,13.29 2.04,19.21 arc-45 1.75,19.91 1.75,27.88 arc-45 2.04,28.58 R16.2
N$44
  Top 0.254: DA4.1 arc45 8.54,34.08 R39.2 7,35.05 arc45 6.71,35.75 C26.2 6,37.86 arc-45 6.29,38.56 C28.-
N$45
  Top 0.254: DA2.8 81.81,15.32 arc45 81.52,16.02 C7.2 | C6.2 16.52,36.02 arc-45 16.81,35.32 DA4.8 15.79,32.79 arc45 15.5,32.09 15.5,25.41 arc45 15.79,24.71 17.46,23.04 arc45 18.16,22.75 21.59,22.75 arc-45 22.29,22.46 22.5,22.25 arc-45 22.79,21.55 C5.2 22.81,19.98 DA1.8 | L1.2 32,41.4 arc-45 31.71,40.69 C1.+
  Bottom 0.254: C3.2 83.03,42 arc-45 82.33,42.29 DA3.8 79.5,42.5 | DA4.8 16.81,34.15 arc-45 17.1,34.85 17.71,35.46 arc-45 18.41,35.75 26.35,35.75 arc45 27.06,36.04 C1.+ | C7.2 80.54,33.3 arc45 80.25,34 79.79,34.46 arc-45 79.5,35.16 79.5,42.5 | 79.5,42.5 71.66,42.5 arc-45 70.96,42.79 70.79,42.96 arc45 70.09,43.25 60.16,43.25 arc-45 59.46,43.54 58.29,44.71 arc45 57.59,45 38.16,45 arc45 37.46,44.71 36.54,43.79 arc-45 35.84,43.5 33.83,43.5 arc45 33.13,43.21 L1.2
N$46
  Top 0.406: L2.1 36,34.34 arc-45 36.29,35.04 36.71,35.46 arc-45 37.41,35.75 45.52,35.75 PCB1.A-15'
  Bottom 0.406: PCB1.B-15 PCB1.A-15 44.95,9.21 arc-45 44.24,9.51 44.05,9.7 arc-46 43.75,10.42 44,33.84 arc-44 44.29,34.54 45.48,35.73 | PCB1.B-15' PCB1.A-15' 45.5,35.73 45.48,35.73 | 45.48,35.73 45.25,35.5 | 45.48,35.73 45.5,35.75
N$47
  Top 0.254: DA3.4 70.14,36.19 arc45 69.44,35.9 C4.1 | C9.1 15.48,6.98 arc-45 15.19,7.68 DA1.4 15.5,9.19 arc90 16.5,10.19 16.5,17.34 arc45 16.21,18.04 16.04,18.21 arc45 15.34,18.5 arc-45 14.69,18.77 C10.1 9.48,23.98 arc-45 9.19,24.68 DA4.4 10,26.19 arc90 11,27.19 11,35.09 arc-45 11.29,35.79 14.21,38.71 arc45 14.5,39.41 14.5,41.59 arc-45 14.79,42.29 17.46,44.96 arc-45 18.16,45.25 25.35,45.25 arc-45 26.06,44.96 C2.-
  Bottom 0.254: DA2.4 70.76,6.19 arc-45 70.06,6.48 C8.1 67.54,9.04 67.96,9.46 arc45 68.25,10.16 68.25,30.84 arc45 67.96,31.54 67.79,31.71 arc-45 67.5,32.41 67.5,33.55 arc-45 67.79,34.25 C4.1 68.5,35 67.54,35.96 arc45 66.84,36.25 62.66,36.25 arc-45 61.96,36.54 61.54,36.96 arc-45 61.25,37.66 61.25,40.09 arc45 60.96,40.79 57.79,43.96 arc45 57.09,44.25 38.58,44.25 arc45 37.88,43.96 L2.2 36,42 34.79,40.79 arc-45 34.09,40.5 29.66,40.5 arc-45 28.96,40.79 28.29,41.46 arc-45 28,42.16 28,42.98 C2.- 28.02,43.02
N$48
  Top 0.254: R41.2 57.08,37.82 arc45 56.79,38.52 PCB1.BOUTR' 55.72,41.87 arc45 55.42,42.58 54.04,43.96 arc45 53.34,44.25 40.91,44.25 arc-45 40.21,44.54 36.79,47.96 arc45 36.09,48.25 18.93,48.25 arc45 18.23,47.96 C28.+
N$49
  Top 0.254: DA4.6 17.98,28.73 19,29.75 19,32.08 R15.1 23.71,31.37 arc-45 24,30.67 C25.1
N$50
  Top 0.254: DA4.2 8.22,31.27 arc-45 7.52,31.56 R16.1 5,40.13 arc-45 5.29,40.83 C26.1
RIO
  Top 0.254: C13.1 13.54,5.04 13.5,5 | 13.5,5 13.04,4.54 arc-45 12.34,4.25 8.41,4.25 arc-45 7.71,4.54 5.04,7.21 arc-45 4.75,7.91 4.75,19.83 R4.1 | PCB1.BINR 55.72,2.63 arc-45 55.42,1.92 55.04,1.54 arc-45 54.34,1.25 17.66,1.25 arc-45 16.96,1.54 13.5,5
  Bottom 0.254: PCB1.BINR 55.72,2.88 arc45 55.96,2.29 arc45 56.66,2 76.34,2 arc45 77.04,2.29 78.71,3.96 arc45 79,4.66 79,32.92 R2.1